# EAGLE design tclient-rev3 (EAGLE 5.09)
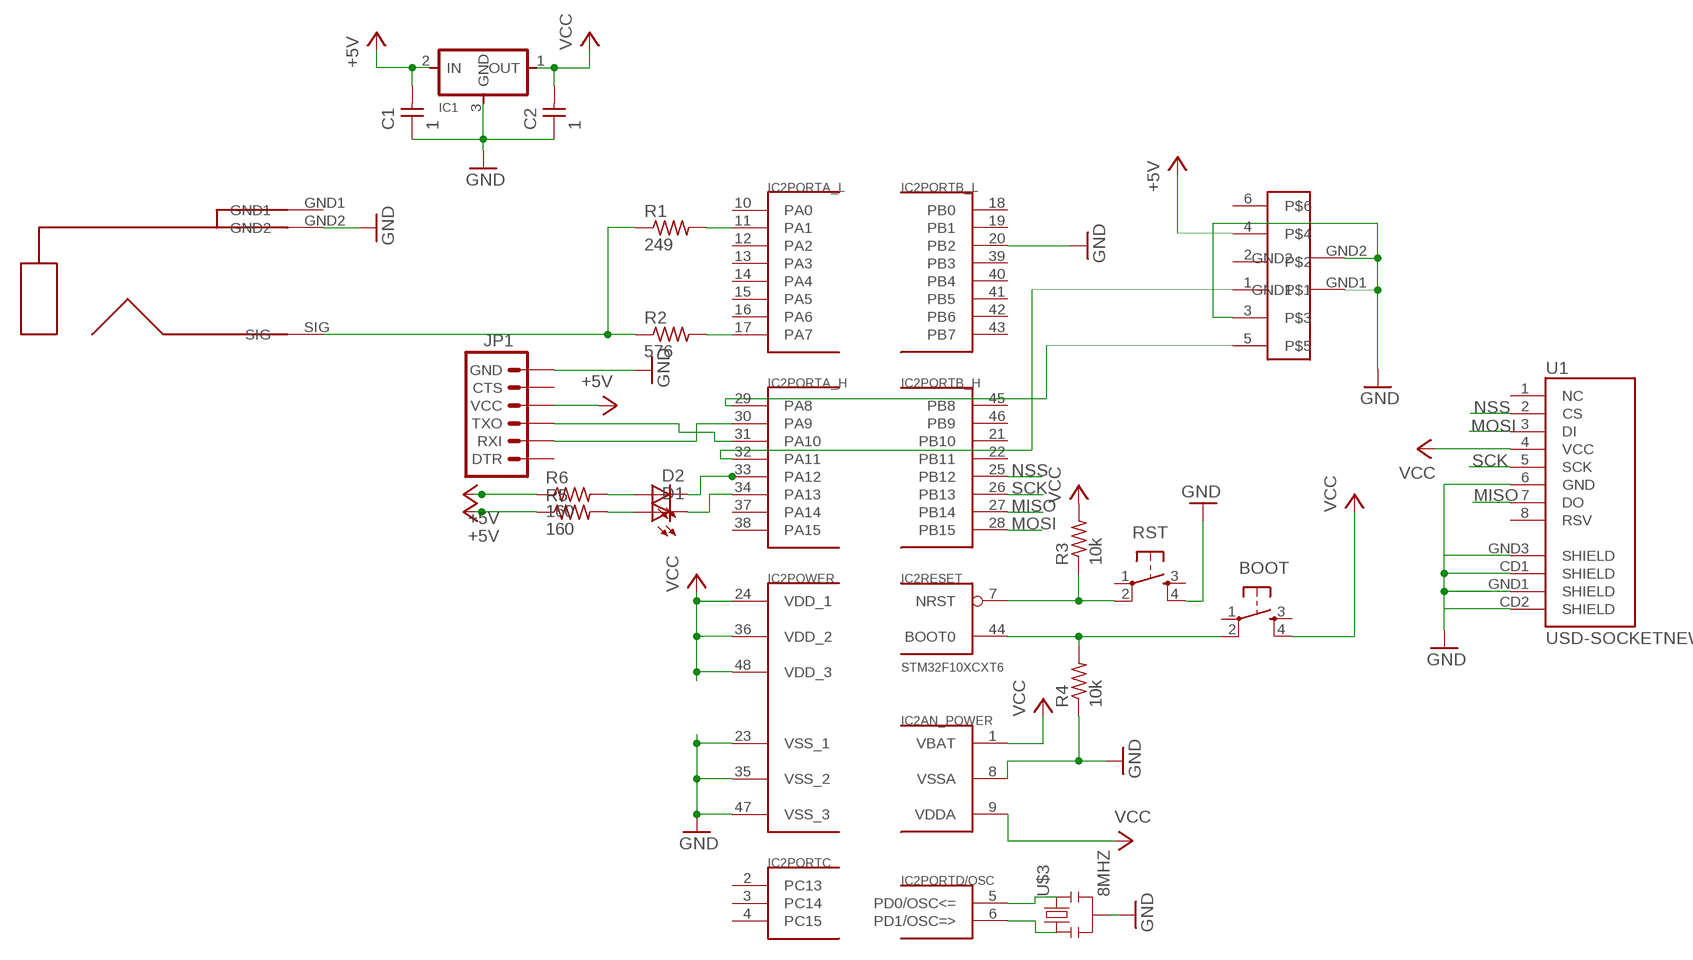
[diagram p0: schematic, sheet 1]

## Parts
BOOT  6MM_SWITCH6MM_SWITCH  [6MM_SWITCH]
C1  1  UNPOLARIZED_CAPACITOR1206  [1206]
C2  1  UNPOLARIZED_CAPACITOR1206  [1206]
D1  LED1206  [1206]
D2  LED1206  [1206]
IC1  REGULATORSOT23  [SOT23]
IC2  STM32F10XCXT6  [TQFP48]
JP1  ARDUINO_SERIAL_PROGRAMSMD  [1X06-SMD]
JP2  SMDRCA  [SMDRCA]
JP3  SMD-MINI-DIV-6  [SMD-MINI-DIN-6]
R1  249  RESISTOR1206  [1206]
R2  576  RESISTOR1206  [1206]
R3  10k  RESISTOR1206  [1206]
R4  10k  RESISTOR1206  [1206]
R5  160  R-US_R1206  [R1206]
R6  160  R-US_R1206  [R1206]
RST  6MM_SWITCH6MM_SWITCH  [6MM_SWITCH]
U1  USD-SOCKETNEW  [MICRO-SD-SOCKET-PP]
U$3  8MHZ  [AWSCR_CV]

## Nets
+5V: C1.2 IC1.2(IN) JP1.4(VCC) JP3.4 R5.1 R6.1
GND: C1.1 C2.1 IC1.3(GND) IC2.8(AN_POWER:VSSA) IC2.20(PORTB_L:PB2) IC2.23(POWER:VSS_1) IC2.35(POWER:VSS_2) IC2.47(POWER:VSS_3) JP1.6(GND) JP2.GND2 JP3.3 JP3.GND1 JP3.GND2 R4.1 RST.4(S1) U1.6(GND) U1.CD1(SHIELD) U1.CD2(SHIELD) U1.GND1(SHIELD) U1.GND3(SHIELD) U$3.P$1
MISO: IC2.27(PORTB_H:PB14) U1.7(DO)
MOSI: IC2.28(PORTB_H:PB15) U1.3(DI)
N$1: IC2.7(RESET:NRST) R3.1 RST.2(P1)
N$2: IC2.32(PORTA_H:PA11) JP3.1
N$3: BOOT.2(P1) IC2.44(RESET:BOOT0) R4.2
N$4: IC2.29(PORTA_H:PA8) JP3.5
N$5: IC2.11(PORTA_L:PA1) R1.2
N$6: IC2.30(PORTA_H:PA9) JP1.2(RXI)
N$7: IC2.31(PORTA_H:PA10) JP1.3(TXO)
N$8: IC2.17(PORTA_L:PA7) R2.2
N$9: D1.1(A) R5.2
N$10: D1.2(C) IC2.34(PORTA_H:PA13)
N$11: JP2.SIG R1.1 R2.1
N$12: IC2.5(PORTD/OSC:PD0/OSC<=) U$3.P$2
N$13: IC2.6(PORTD/OSC:PD1/OSC=>) U$3.P$3
N$14: D2.2(C) IC2.33(PORTA_H:PA12)
N$15: D2.1(A) R6.2
NSS: IC2.25(PORTB_H:PB12) U1.2(CS)
SCK: IC2.26(PORTB_H:PB13) U1.5(SCK)
VCC: BOOT.4(S1) C2.2 IC1.1(OUT) IC2.1(AN_POWER:VBAT) IC2.9(AN_POWER:VDDA) IC2.24(POWER:VDD_1) IC2.36(POWER:VDD_2) IC2.48(POWER:VDD_3) R3.2 U1.4(VCC)
Unconnected: BOOT.1(P) BOOT.3(S) IC2.2(PORTC:PC13) IC2.3(PORTC:PC14) IC2.4(PORTC:PC15) IC2.10(PORTA_L:PA0) IC2.12(PORTA_L:PA2) IC2.13(PORTA_L:PA3) IC2.14(PORTA_L:PA4) IC2.15(PORTA_L:PA5) IC2.16(PORTA_L:PA6) IC2.18(PORTB_L:PB0) IC2.19(PORTB_L:PB1) IC2.21(PORTB_H:PB10) IC2.22(PORTB_H:PB11) IC2.37(PORTA_H:PA14) IC2.38(PORTA_H:PA15) IC2.39(PORTB_L:PB3) IC2.40(PORTB_L:PB4) IC2.41(PORTB_L:PB5) IC2.42(PORTB_L:PB6) IC2.43(PORTB_L:PB7) IC2.45(PORTB_H:PB8) IC2.46(PORTB_H:PB9) JP1.1(DTR) JP1.5(CTS) JP2.GND1 JP3.2 JP3.6 RST.1(P) RST.3(S) U1.1(NC) U1.8(RSV)

## Library data of the parts
BOOT RST = ng:6MM_SWITCH: OMRON SWITCH
C1 C2 = ng:UNPOLARIZED_CAPACITOR: unpolarized_capacitor
D1 D2 = ng:LED
IC1 = ng:REGULATOR
IC2 = stm32:STM32F10XCXT6: ST STM32F101/103 48pin LQFP
JP1 = SparkFun:ARDUINO_SERIAL_PROGRAM
JP2 = thinner-client:SMDRCA
JP3 = thinner-client:SMD-MINI-DIV-6
R1-R4 = ng:RESISTOR
R5 R6 = rcl:R-US_: RESISTOR, American symbol
U1 = SparkFun:USD-SOCKET: microSD Socket Push-push type uSD socket. Schematic element and footprint production proven. Spark Fun Electronics SKU : PRT-00127. tDoc lines correctly indicate media card edge positions when inserting (unlocked, locked, depressed).
U$3 = thinner-client:8MHZ

## Board
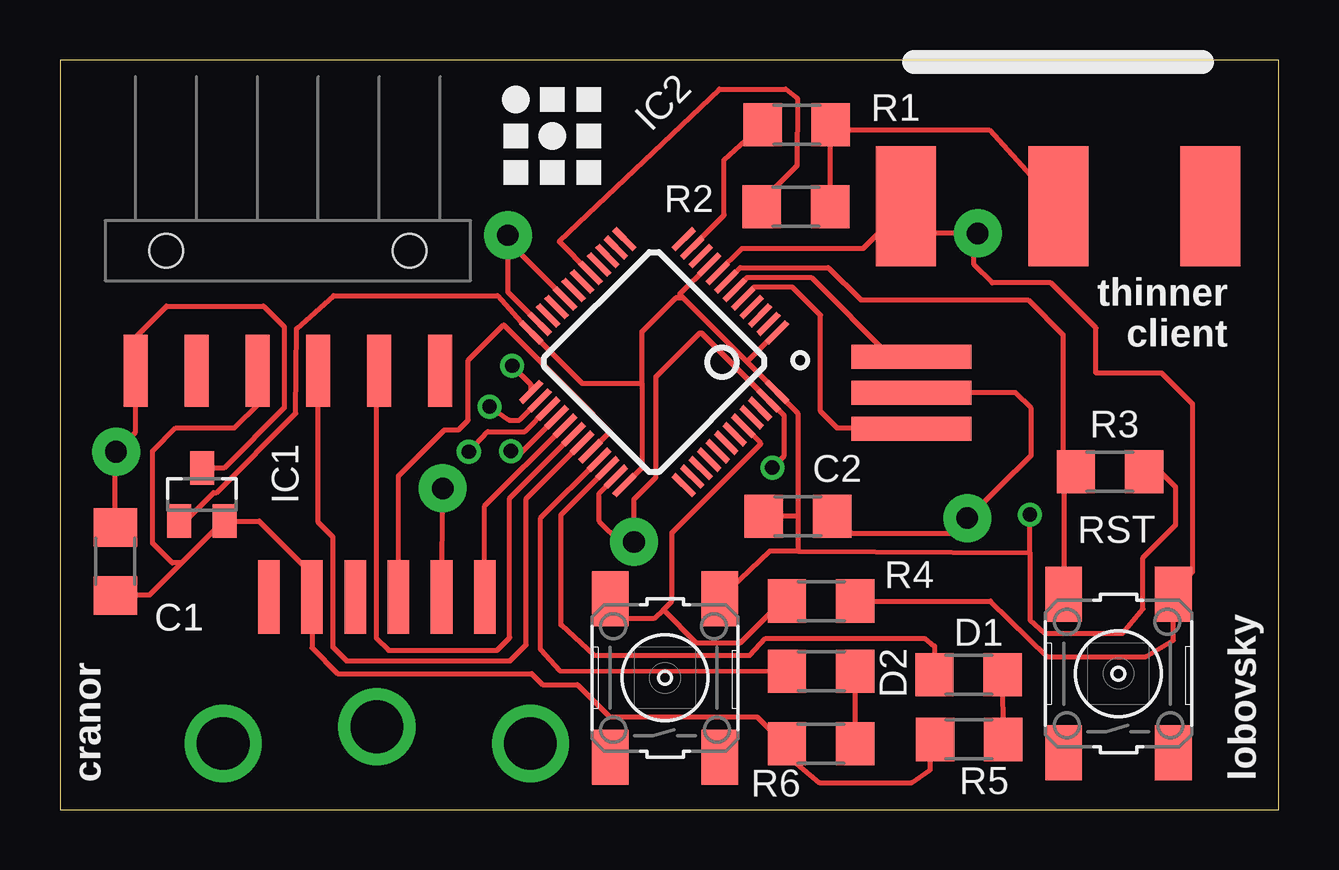
[diagram p1: board, top side]
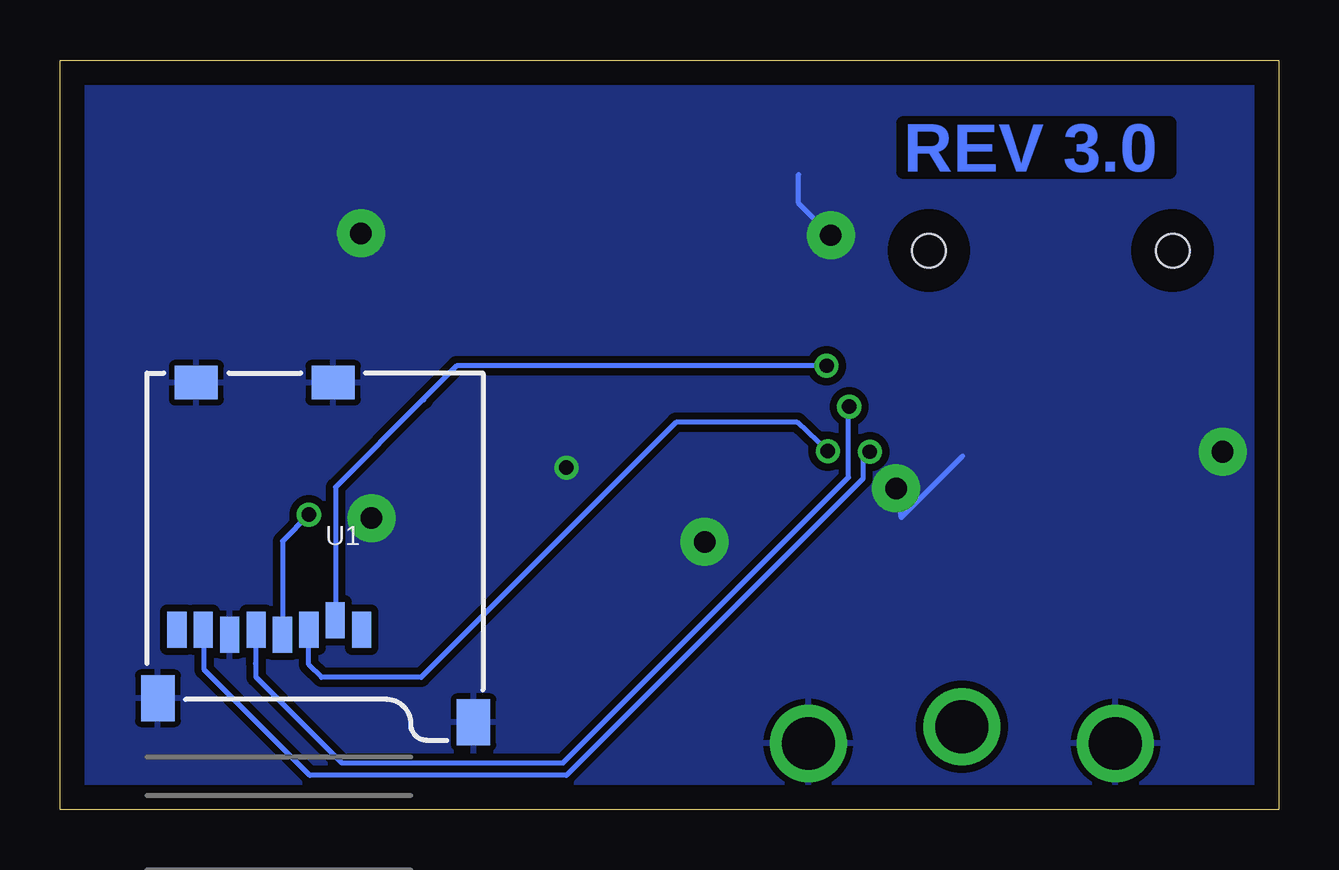
[diagram p2: board, bottom side, seen from below]

Size 50.8 x 31.23 mm. Coordinates in mm from the lower left corner, seen from the top.
Outline: 0,0 50.8,0 50.8,31.23 0,31.23 0,0
Copper layers (1*16): Top 0.035mm / dielectric 1.5mm / Bottom 0.035mm
Design rules "default *": minimum track width 8mil, minimum drill 15mil, track to track 8mil, track to pad 8mil, pad to pad 8mil, via to via 8mil, smd to smd 2mil, copper to edge 40mil, drill to drill 8mil, minimum pad ring 10mil, minimum via ring 8mil, stop-mask expansion 4mil, vias tented up to drill 40mil, thermal gap 10mil

### Footprints (pad centres in the part's own frame; a part is rotated, then mirrored left to right if it is on the bottom)
6MM_SWITCH = smd 2.286 x 1.524: 1 -3.302,2.286; 2 3.302,2.286; 3 -3.302,-2.286; 4 3.302,-2.286
1206 = smd 1.6 x 1.803: 1 -1.422,0; 2 1.422,0
SOT23 = smd 1 x 1.4: 1 -0.95,-1.1; 2 0.95,-1.1; 3 0,1.1
TQFP48 = smd 0.25 x 1.2: 1 -2.75,-4.5; 2 -2.25,-4.5; 3 -1.75,-4.5; 4 -1.25,-4.5; 5 -0.75,-4.5; 6 -0.25,-4.5; 7 0.25,-4.5; 8 0.75,-4.5; 9 1.25,-4.5; 10 1.75,-4.5; 11 2.25,-4.5; 12 2.75,-4.5; 25 2.75,4.5; 26 2.25,4.5; 27 1.75,4.5; 28 1.25,4.5; 29 0.75,4.5; 30 0.25,4.5; 31 -0.25,4.5; 32 -0.75,4.5; 33 -1.25,4.5; 34 -1.75,4.5; 35 -2.25,4.5; 36 -2.75,4.5 | smd 1.2 x 0.25: 13 4.5,-2.75; 14 4.5,-2.25; 15 4.5,-1.75; 16 4.5,-1.25; 17 4.5,-0.75; 18 4.5,-0.25; 19 4.5,0.25; 20 4.5,0.75; 21 4.5,1.25; 22 4.5,1.75; 23 4.5,2.25; 24 4.5,2.75; 37 -4.5,2.75; 38 -4.5,2.25; 39 -4.5,1.75; 40 -4.5,1.25; 41 -4.5,0.75; 42 -4.5,0.25; 43 -4.5,-0.25; 44 -4.5,-0.75; 45 -4.5,-1.25; 46 -4.5,-1.75; 47 -4.5,-2.25; 48 -4.5,-2.75
1X06-SMD = smd 1 x 3: 1 -6.35,5; 2 -3.81,5; 3 -1.27,5; 4 1.27,5; 5 3.81,5; 6 6.35,5 | hole 1.4: -5.08,0; 5.08,0
SMDRCA = smd 2.5 x 5: GND1 -6.35,0; GND2 6.35,0; SIG 0,0
SMD-MINI-DIN-6 = smd 0.9 x 3.048: 1 0.9,5.404; 2 -0.9,5.404; 3 2.7,5.404; 4 -2.7,5.404; 5 4.5,5.404; 6 -4.5,5.404 | drill 2.2 pad 3 round: GND1 -6.4,-0.7; GND2 6.4,-0.7; GND3 0,0
R1206 = smd 1.6 x 1.803: 1 -1.422,0; 2 1.422,0
MICRO-SD-SOCKET-PP = smd 0.8 x 1.5: 1 -8.94,10.7; 2 -7.84,10.3; 3 -6.74,10.7; 4 -5.64,10.9; 5 -4.54,10.7; 6 -3.44,10.9; 7 -2.34,10.7; 8 -1.24,10.7 | smd 1.8 x 1.4: CD1 -2.05,0.4; CD2 -7.75,0.4 | smd 1.4 x 1.9: GND1 -13.6,14.55; GND3 -0.45,13.55
AWSCR_CV = smd 1 x 5: P$1 0,0; P$2 1.5,0; P$3 -1.5,0

### Placement (x,y rotation side)
BOOT  25.22,5.49 90 top
C1  2.31,10.34 270 top
C2  30.76,12.22 180 top
D1  37.87,5.61 180 top
D2  31.72,5.77 180 top
IC1  5.92,13.13 0 top
IC2  24.77,18.64 135 top
JP1  9.5,23.29 180 top
JP2  41.61,25.15 180 top
JP3  13.21,3.45 0 top
R1  30.71,28.53 180 top
R2  30.68,25.11 180 top
R3  43.76,14.07 0 top
R4  31.72,8.69 180 top
R5  37.9,2.92 0 top
R6  31.72,2.74 0 top
RST  44.12,5.66 90 top
U1  47.17,18.19 180 bottom
U$2  [CBA]  20.52,28.07 0 top
U$3  35.48,17.37 270 top

### Tracks (layer width: path | path; a pad name or v marks a point on that pad's centre or on a via)
+5V
  Top 0.203: 5.07,10.27 3.73,8.94 2.31,8.94 C1.2 | 5.07,10.27 6.78,11.99 IC1.2 6.88,12.01 8.31,12.01 10.49,9.83 10.49,8.97 JP3.4 10.51,6.74 11.58,5.66 19.66,5.66 20.12,5.21 21.57,5.21 22.91,3.86 29.06,3.86 30.05,2.87 30.05,2.52 30.33,2.23 | 8.23,18.19 JP1.4 8.28,18.24 8.28,16.92 7.26,15.9 4.83,15.9 3.86,14.94 3.86,11.1 4.69,10.27 5.07,10.27 | 30.33,2.23 31.65,1.12 35.51,1.12 36.27,1.65 36.3,2.41 R5.1 | 30.33,2.23 R6.1
GND  (via drill 0.6, 0.89 pad 2, 0.9 pad 2)
  Top 0.203: 46.41,7.06 46.41,7.04 | 46.41,7.06 RST.4 47.22,9.91 47.22,16.89 45.92,18.19 43.18,18.19 43.18,20.07 41.3,21.95 38.86,21.95 38.1,22.71 38.1,24 | IC2.8 28.42,23.37 33.48,23.37 JP2.GND2 36.4,24 38.1,24 | IC1.3 6.84,14.23 9.35,16.74 9.35,20.12 8.48,20.98 4.45,20.98 3.17,19.71 3.17,18.32 JP1.6 3.15,15.72 v2.34,14.91 2.31,14.88 C1.1 | JP3.3 15.93,8.98 v15.95,13.39 | IC2.23 18.67,21.56 v18.67,23.93 19.18,23.42 19.18,23.19 21.05,21.32 IC2.20 | 38.1,24 v38.25,24 | C2.1 32.28,12.22 32.99,11.51 37.39,11.51 v37.82,12.14 40.49,14.76 40.49,16.71 39.83,17.37 U$3.P$1 | IC2.35 22.48,13.18 22.48,12.01 23.34,11.15 v23.93,11.15 23.93,12.93 24.84,13.84 24.84,18.03 26.67,19.86 26.73,19.86 | 46.41,7.06 45.26,6.38 41.15,6.38 38.79,8.69 R4.1 | 26.73,19.86 IC2.47 | 26.73,19.86 26.75,19.86 30.18,16.43 30.18,14.73 v29.69,14.25
  Bottom 0.203: v15.95,13.39 15.75,12.17 13.18,14.73 | v18.67,23.93 20.02,25.27 20.02,26.47 | v29.69,14.25 29.67,14.25
  pour Bottom (isolate 0.305): 0.66,30.68 50.19,30.68 50.19,0.46 0.64,0.46 0.64,30.66
MISO  (via drill 0.6)
  Top 0.203: IC2.27 20.33,16.7 19.38,15.75 17.83,15.75 v17.04,14.91
  Bottom 0.203: U1.7 44.78,7.44 44.78,5.82 40.39,1.42 29.69,1.42 17.32,13.79 17.32,14.63 v17.04,14.91 17.35,14.61
MOSI  (via drill 0.6)
  Top 0.203: v18.8,14.94 18.88,14.53 IC2.28
  Bottom 0.203: U1.3 40.43,6.04 39.9,5.51 35.74,5.51 25.12,16.13 20.07,16.13 v18.8,14.94
N$1
  Top 0.203: 27.79,22.02 IC2.7 28.35,22.58 32.03,22.58 33.38,21.23 40.36,21.23 41.81,19.79 41.81,13.97 41.83,13.95 | R3.1 | 41.83,13.95 RST.2 | 41.83,13.95 41.83,14.45 R3.1 | R3.1 42.34,14.22
N$2
  Top 0.203: 14.12,8.94 JP3.1 14.11,13.9 16.03,15.82 16.61,15.82 17.02,16.23 17.02,18.72 18.49,20.19 21.51,17.17 | 21.51,17.17 21.51,17.16 | 21.51,17.17 22.94,15.75 22.93,15.75 IC2.32
N$3
  Top 0.203: 28.5,15.98 IC2.44 29.21,15.26 29.21,15.24 25.5,11.53 25.5,8.69 25.15,8.33 | 25.15,8.33 24.79,7.98 23.34,7.98 22.94,8.38 BOOT.2 | 25.15,8.33 26.52,6.96 28.37,6.96 30.1,8.69 R4.2
N$4
  Top 0.203: IC2.29 17.71,12.65 JP3.5
N$5
  Top 0.203: IC2.11 26.36,23.44 27.69,24.77 27.69,27.08 R1.2 29.31,28.7
N$6
  Top 0.203: JP1.2 13.31,17.12 13.21,17.02 13.21,7.11 13.69,6.63 18.21,6.63 18.75,7.16 18.75,12.98 IC2.30
N$7
  Top 0.203: JP1.3 10.77,11.96 11.38,11.35 11.38,6.76 11.94,6.2 18.77,6.2 19.43,6.86 19.43,12.96 IC2.31
N$8
  Top 0.203: IC2.17 22.1,22.38 20.8,23.67 27.48,30.02 30.25,30.02 30.73,29.64 30.71,26.82 29.25,25.37 R2.2
N$9
  Top 0.203: R5.2 D1.1
N$10
  Top 0.203: IC2.34 20.88,12.28 20.88,7.7 22.25,6.43 28.75,6.43 29.41,7.14 36.04,7.14 36.45,6.81 D1.2
N$11
  Top 0.203: R2.1 32.11,28.68 32.13,28.7 R1.1 32.13,28.32 38.73,28.32 JP2.SIG
N$12
  Top 0.203: IC2.5 28.48,21.31 28.93,21.77 30.53,21.77 31.7,20.6 31.7,16.59 32.38,15.9 35.46,15.9 U$3.P$2
N$13
  Top 0.203: IC2.6 28.65,22.17 31.32,22.17 34.62,18.87 U$3.P$3
N$14
  Top 0.203: IC2.33 20.04,12.15 20.04,6.66 20.83,5.79 D2.2
N$15
  Top 0.203: R6.2 D2.1
NSS  (via drill 0.6)
  Top 0.203: IC2.25 19.64,17.7 v18.85,18.49
  Bottom 0.203: 35.66,17.09 39.32,13.44 U1.2 | 35.66,17.09 35.64,17.07 | v18.85,18.49 34.27,18.49 35.66,17.09
SCK  (via drill 0.6)
  Top 0.203: IC2.26 19.97,17.05 19.15,16.23 18.72,16.23 v17.91,16.79
  Bottom 0.203: 42.65,6.1 42.65,7.47 U1.5 42.63,5.52 39.04,1.93 29.84,1.93 17.93,13.84 17.93,16.76 v17.91,16.79
VCC  (via drill 0.6)
  Top 0.203: IC2.1 29.9,19.86 29.84,19.86 28.64,18.66 | R3.2 | R3.2 45.14,13.99 | 23.55,13.54 IC2.36 24.28,14.27 24.28,14.3 24.26,14.33 24.26,17.75 | IC2.9 27.05,22.68 25.83,21.46 25.96,21.34 | IC1.1 5.23,12.04 6.4,13.21 6.53,13.21 9.83,16.51 9.86,20.04 11.4,21.41 18.24,21.41 19.56,19.94 IC2.24 19.66,19.86 21.77,17.75 24.26,17.75 | 30.76,12.22 30.76,16.51 29.95,17.32 IC2.48 29.87,17.42 28.64,18.66 | 30.76,12.22 30.76,10.77 | 40.44,10.69 v40.43,12.29 v40.43,12.3 | 25.96,21.34 28.64,18.66 | 30.76,12.22 C2.2 | 30.76,10.77 40.44,10.69 | 24.26,17.75 24.26,19.91 25.68,21.34 25.96,21.34 | BOOT.4 29.59,10.77 30.76,10.77 | R3.2 45.87,14.07 46.51,13.44 46.51,11.86 45.14,10.49 45.14,8.36 44.3,7.34 41.05,7.34 40.44,7.9 40.44,10.69
  Bottom 0.203: U1.4 41.53,11.19 v40.43,12.29

### Text on the board
Bottom: REV 3.0
tNames: thinner | client | cranor | lobovsky